# EAGLE design prog (EAGLE 7.5.0)
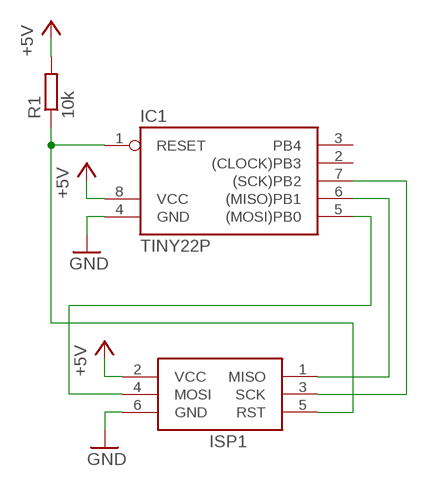
[diagram p0: schematic, sheet 1]

## Parts
IC1  TINY22P  [DIL08]
ISP1  AVRISP-6  [AVRISP]
R1  10k  R-EU_0204/7  [0204/7]

## Nets
+5V: IC1.8(VCC) ISP1.2(VCC) R1.2
GND: IC1.4(GND) ISP1.6(GND)
N$1: IC1.1(RESET) ISP1.5(RST) R1.1
N$3: IC1.5((MOSI)PB0) ISP1.4(MOSI)
N$4: IC1.6((MISO)PB1) ISP1.1(MISO)
N$5: IC1.7((SCK)PB2) ISP1.3(SCK)
Unconnected: IC1.2((CLOCK)PB3) IC1.3(PB4)

## Library data of the parts
IC1 = atmel:TINY22: MICROCONTROLLER 1K ROM 128 bytes RAM 128 bytes EEPROM; OC_FARNELL: unknown; OC_NEWARK: unknown
ISP1 = adafruit:AVRISP: AVR ISP HEADER Standard 6 pin header for AVR programming
R1 = rcl:R-EU_: RESISTOR, European symbol

## Board
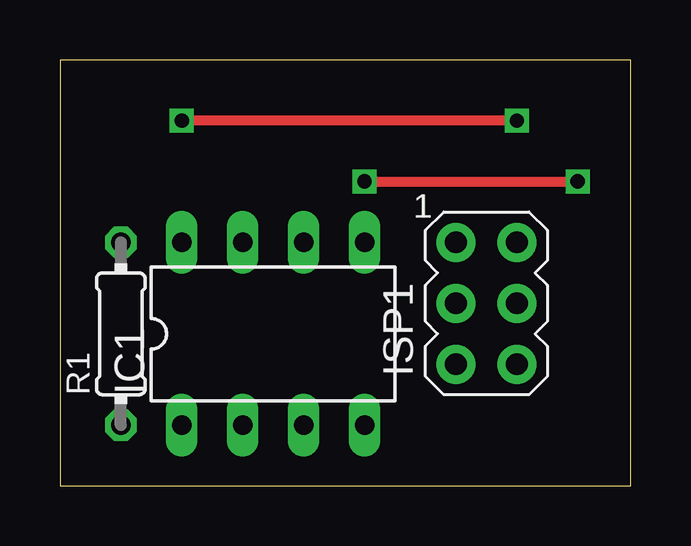
[diagram p1: board, top side]
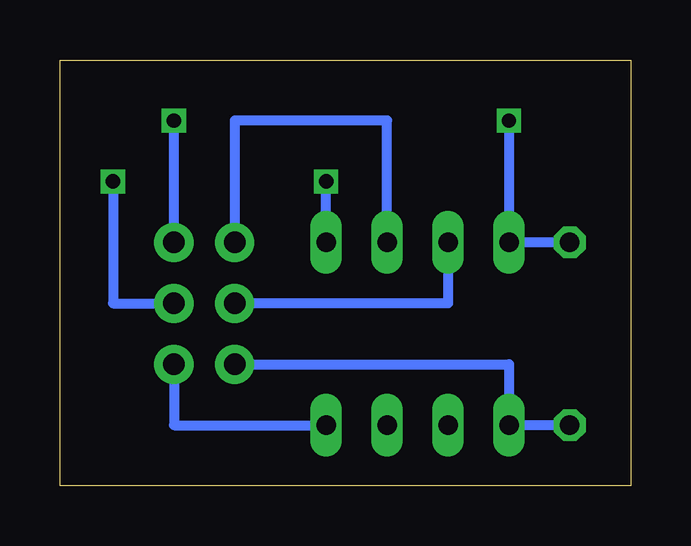
[diagram p2: board, bottom side, seen from below]

Size 23.8 x 17.77 mm. Coordinates in mm from the lower left corner, seen from the top.
Outline: 0,0 23.8,0 23.8,17.77 0,17.77 0,0
Copper layers (1*16): Top 0.035mm / dielectric 1.5mm / Bottom 0.035mm
Design rules "default": minimum track width 10mil, minimum drill 24mil, track to track 8mil, track to pad 8mil, pad to pad 8mil, via to via 8mil, smd to smd 8mil, copper to edge 40mil, drill to drill 8mil, minimum pad ring 10mil, minimum via ring 8mil, stop-mask expansion 4mil, vias tented up to drill 0mil, thermal gap 10mil

### Footprints (pad centres in the part's own frame; a part is rotated, then mirrored left to right if it is on the bottom)
DIL08 = drill 0.813 long: 1 -3.81,-3.81; 2 -1.27,-3.81; 3 1.27,-3.81; 4 3.81,-3.81; 5 3.81,3.81; 6 1.27,3.81; 7 -1.27,3.81; 8 -3.81,3.81
AVRISP = drill 0.9 pad 1.626: 1 -1.27,2.54; 2 1.27,2.54; 3 -1.27,0; 4 1.27,0; 5 -1.27,-2.54; 6 1.27,-2.54
0204/7 = drill 0.813 octagon: 1 -3.81,0; 2 3.81,0

### Placement (x,y rotation side)
IC1  8.89,6.35 0 top
ISP1  17.78,7.62 0 top
R1  2.54,6.35 90 top

### Tracks (layer width: path | path; a pad name or v marks a point on that pad's centre or on a via)
+5V  (via drill 0.6)
  Top 0.406: v19.05,15.24 v5.08,15.24
  Bottom 0.406: ISP1.2 v19.05,15.24 | R1.2 IC1.8 v5.08,15.24
GND
  Bottom 0.406: ISP1.6 19.05,2.54 IC1.4
N$1
  Bottom 0.406: ISP1.5 5.08,5.08 IC1.1 R1.1
N$3  (via drill 0.6)
  Top 0.406: v12.7,12.7 v21.59,12.7
  Bottom 0.406: IC1.5 v12.7,12.7 | v21.59,12.7 21.59,7.62 ISP1.4
N$4
  Bottom 0.406: IC1.6 10.16,15.24 16.51,15.24 ISP1.1
N$5
  Bottom 0.406: IC1.7 7.62,7.62 ISP1.3